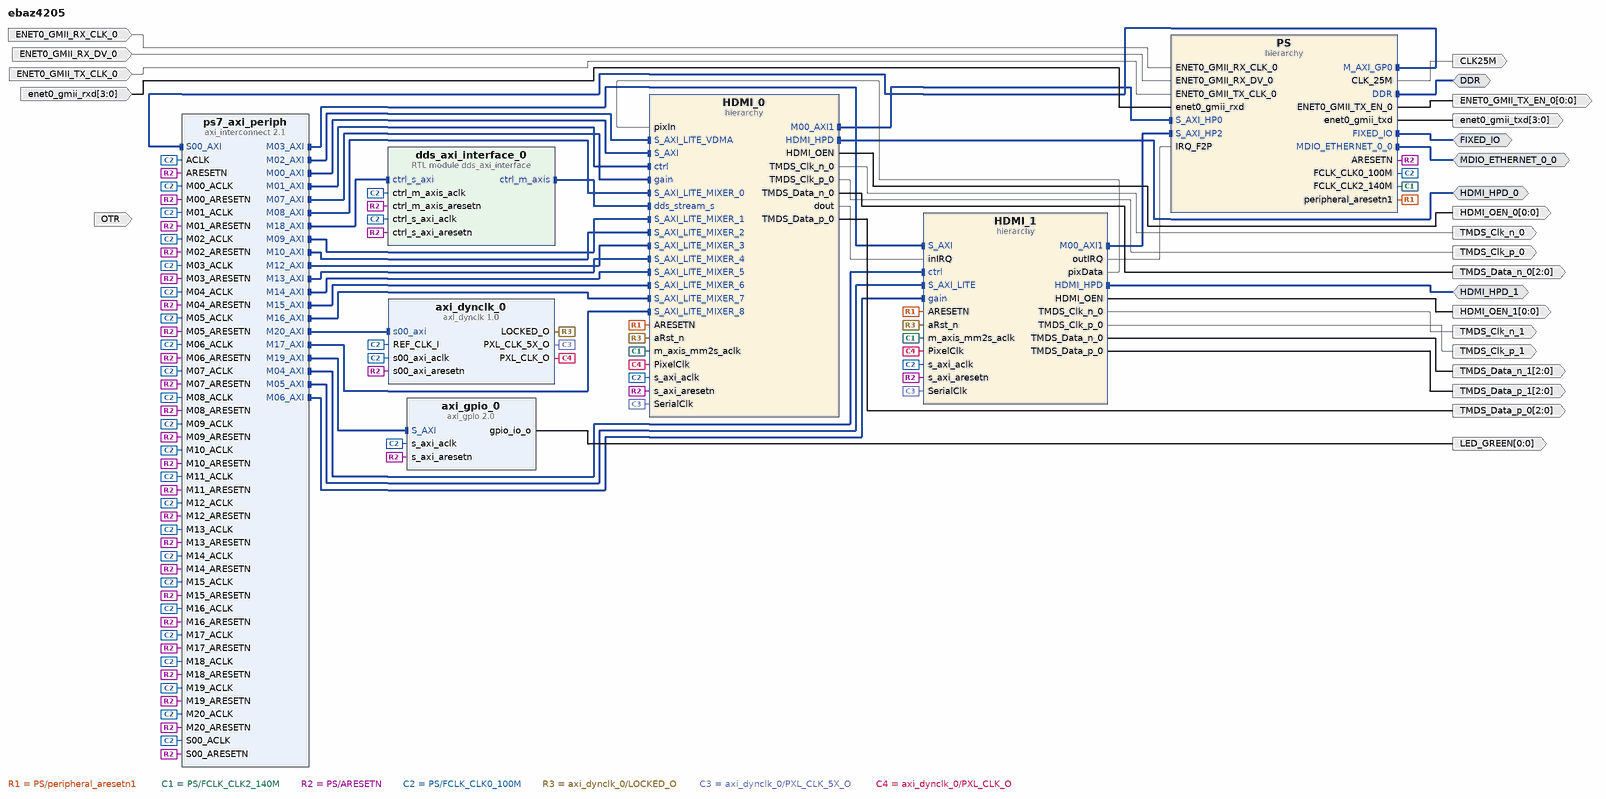
[diagram p0: block diagram of the top level]
# Vivado block design ebaz4205, xc7z010clg400-1, Vivado 2022.2
create_bd_design ebaz4205

create_bd_intf_port -mode Master -vlnv xilinx.com:interface:ddrx_rtl:1.0 DDR
create_bd_intf_port -mode Master -vlnv xilinx.com:display_processing_system7:fixedio_rtl:1.0 FIXED_IO
create_bd_intf_port -mode Master -vlnv xilinx.com:interface:mdio_rtl:1.0 MDIO_ETHERNET_0_0
create_bd_intf_port -mode Master -vlnv xilinx.com:interface:gpio_rtl:1.0 HDMI_HPD_0
create_bd_intf_port -mode Master -vlnv xilinx.com:interface:gpio_rtl:1.0 HDMI_HPD_1
create_bd_port -dir I -type clk ENET0_GMII_RX_CLK_0
create_bd_port -dir I ENET0_GMII_RX_DV_0
create_bd_port -dir I -type clk ENET0_GMII_TX_CLK_0
create_bd_port -dir O -from 0 -to 0 ENET0_GMII_TX_EN_0
create_bd_port -dir I -from 3 -to 0 enet0_gmii_rxd
create_bd_port -dir O -from 3 -to 0 enet0_gmii_txd
create_bd_port -dir O -type clk CLK25M
set_property -dict {CONFIG.FREQ_HZ 25000000} [get_bd_ports CLK25M]
create_bd_port -dir I -type data OTR
create_bd_port -dir O -from 0 -to 0 -type data LED_GREEN
create_bd_port -dir O -from 0 -to 0 HDMI_OEN_0
create_bd_port -dir O TMDS_Clk_p_0
create_bd_port -dir O TMDS_Clk_n_0
create_bd_port -dir O -from 2 -to 0 TMDS_Data_p_0
create_bd_port -dir O -from 2 -to 0 TMDS_Data_n_0
create_bd_port -dir O -from 0 -to 0 HDMI_OEN_1
create_bd_port -dir O TMDS_Clk_n_1
create_bd_port -dir O TMDS_Clk_p_1
create_bd_port -dir O -from 2 -to 0 TMDS_Data_n_1
create_bd_port -dir O -from 2 -to 0 TMDS_Data_p_1

create_bd_cell -type hier PS
create_bd_cell -type hier HDMI_0
create_bd_cell -type ip -vlnv xilinx.com:ip:axi_interconnect:2.1 ps7_axi_periph
set_property -dict [list \
  CONFIG.ENABLE_ADVANCED_OPTIONS 0 \
  CONFIG.NUM_MI 21 \
  CONFIG.NUM_SI 1 \
  CONFIG.STRATEGY 1 \
] [get_bd_cells ps7_axi_periph]
create_bd_cell -type hier HDMI_1
create_bd_cell -type ip -vlnv xilinx.com:ip:axi_gpio:2.0 axi_gpio_0
set_property -dict {CONFIG.C_GPIO_WIDTH 1} [get_bd_cells axi_gpio_0]
create_bd_cell -type ip -vlnv digilentinc.com:ip:axi_dynclk:1.0 axi_dynclk_0
create_bd_cell -type module -reference dds_axi_interface dds_axi_interface_0

# ---- hierarchy /PS ----
current_bd_instance /PS
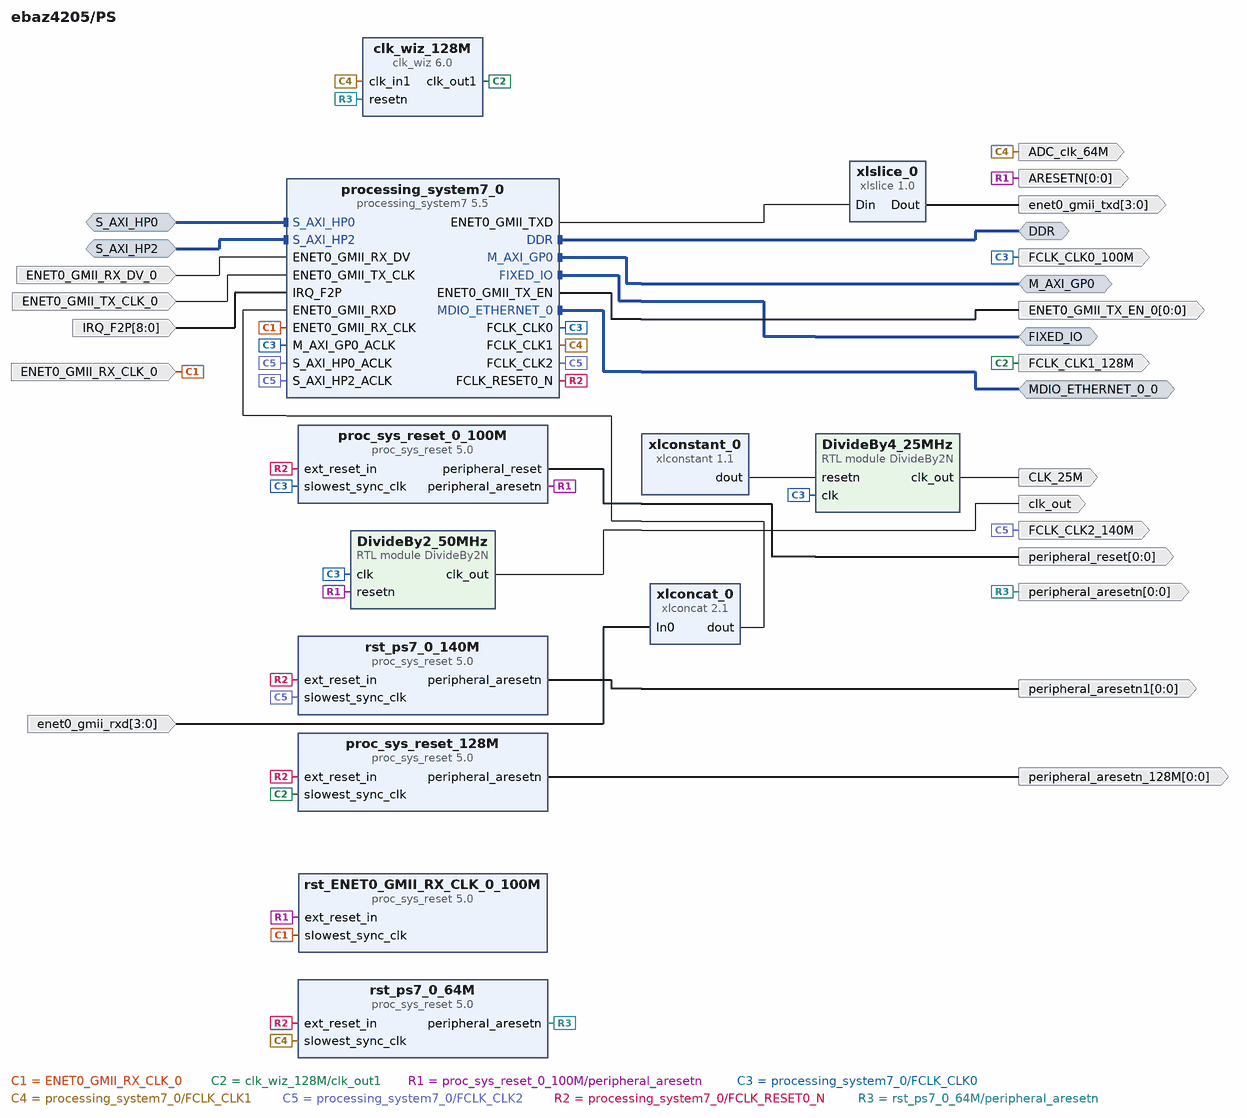
[diagram p1: block diagram inside /PS]
create_bd_intf_pin -mode Master -vlnv xilinx.com:interface:mdio_rtl:1.0 MDIO_ETHERNET_0_0
create_bd_intf_pin -mode Master -vlnv xilinx.com:interface:ddrx_rtl:1.0 DDR
create_bd_intf_pin -mode Master -vlnv xilinx.com:display_processing_system7:fixedio_rtl:1.0 FIXED_IO
create_bd_intf_pin -mode Slave -vlnv xilinx.com:interface:aximm_rtl:1.0 S_AXI_HP0
create_bd_intf_pin -mode Master -vlnv xilinx.com:interface:aximm_rtl:1.0 M_AXI_GP0
create_bd_intf_pin -mode Slave -vlnv xilinx.com:interface:aximm_rtl:1.0 S_AXI_HP2
create_bd_pin -dir O -from 0 -to 0 ENET0_GMII_TX_EN_0
create_bd_pin -dir I -type clk ENET0_GMII_RX_CLK_0
create_bd_pin -dir I ENET0_GMII_RX_DV_0
create_bd_pin -dir I -type clk ENET0_GMII_TX_CLK_0
create_bd_pin -dir O -type clk FCLK_CLK0_100M
create_bd_pin -dir O -type clk CLK_25M
create_bd_pin -dir O -from 3 -to 0 enet0_gmii_txd
create_bd_pin -dir O -from 0 -to 0 -type rst ARESETN
create_bd_pin -dir I -from 3 -to 0 enet0_gmii_rxd
create_bd_pin -dir O -type clk FCLK_CLK1_128M
create_bd_pin -dir O -from 0 -to 0 -type rst peripheral_reset
create_bd_pin -dir O -from 0 -to 0 -type rst peripheral_aresetn_128M
create_bd_pin -dir O -type clk FCLK_CLK2_140M
create_bd_pin -dir O -from 0 -to 0 -type rst peripheral_aresetn1
create_bd_pin -dir I -from 8 -to 0 -type intr IRQ_F2P
create_bd_pin -dir O ADC_clk_64M
create_bd_pin -dir O -from 0 -to 0 -type rst peripheral_aresetn
create_bd_pin -dir O clk_out

create_bd_cell -type ip -vlnv xilinx.com:ip:xlslice:1.0 xlslice_0
set_property -dict {CONFIG.DIN_FROM 3 CONFIG.DIN_TO 0 CONFIG.DIN_WIDTH 8 CONFIG.DOUT_WIDTH 4} [get_bd_cells xlslice_0]
create_bd_cell -type ip -vlnv xilinx.com:ip:xlconcat:2.1 xlconcat_0
set_property -dict {CONFIG.IN0_WIDTH 4 CONFIG.IN1_WIDTH 4 CONFIG.NUM_PORTS 2} [get_bd_cells xlconcat_0]
create_bd_cell -type ip -vlnv xilinx.com:ip:xlconstant:1.1 xlconstant_0
create_bd_cell -type module -reference DivideBy2N DivideBy2_50MHz
set_property -dict {CONFIG.N 1 CONFIG.WIDTH 2} [get_bd_cells DivideBy2_50MHz]
create_bd_cell -type ip -vlnv xilinx.com:ip:proc_sys_reset:5.0 proc_sys_reset_128M
create_bd_cell -type ip -vlnv xilinx.com:ip:proc_sys_reset:5.0 rst_ENET0_GMII_RX_CLK_0_100M
create_bd_cell -type ip -vlnv xilinx.com:ip:clk_wiz:6.0 clk_wiz_128M
set_property -dict [list \
  CONFIG.CLKIN1_JITTER_PS 156.25 \
  CONFIG.CLKOUT1_DRIVES BUFG \
  CONFIG.CLKOUT1_JITTER 149.670 \
  CONFIG.CLKOUT1_PHASE_ERROR 114.696 \
  CONFIG.CLKOUT1_REQUESTED_OUT_FREQ 128 \
  CONFIG.CLKOUT2_DRIVES BUFG \
  CONFIG.CLKOUT3_DRIVES BUFG \
  CONFIG.CLKOUT4_DRIVES BUFG \
  CONFIG.CLKOUT5_DRIVES BUFG \
  CONFIG.CLKOUT6_DRIVES BUFG \
  CONFIG.CLKOUT7_DRIVES BUFG \
  CONFIG.MMCM_BANDWIDTH OPTIMIZED \
  CONFIG.MMCM_CLKFBOUT_MULT_F 14 \
  CONFIG.MMCM_CLKIN1_PERIOD 15.625 \
  CONFIG.MMCM_CLKIN2_PERIOD 10.000 \
  CONFIG.MMCM_CLKOUT0_DIVIDE_F 7 \
  CONFIG.MMCM_COMPENSATION ZHOLD \
  CONFIG.PRIMITIVE PLL \
  CONFIG.PRIM_IN_FREQ 64.000 \
  CONFIG.RESET_PORT resetn \
  CONFIG.RESET_TYPE ACTIVE_LOW \
] [get_bd_cells clk_wiz_128M]
create_bd_cell -type module -reference DivideBy2N DivideBy4_25MHz
set_property -dict {CONFIG.N 2 CONFIG.WIDTH 2} [get_bd_cells DivideBy4_25MHz]
create_bd_cell -type ip -vlnv xilinx.com:ip:proc_sys_reset:5.0 proc_sys_reset_0_100M
create_bd_cell -type ip -vlnv xilinx.com:ip:processing_system7:5.5 processing_system7_0
set_property -dict [list \
  CONFIG.PCW_APU_PERIPHERAL_FREQMHZ 666.666666 \
  CONFIG.PCW_ENET0_ENET0_IO EMIO \
  CONFIG.PCW_ENET0_GRP_MDIO_ENABLE 1 \
  CONFIG.PCW_ENET0_GRP_MDIO_IO EMIO \
  CONFIG.PCW_ENET0_PERIPHERAL_ENABLE 1 \
  CONFIG.PCW_ENET0_PERIPHERAL_FREQMHZ {100 Mbps} \
  CONFIG.PCW_ENET0_RESET_ENABLE 0 \
  CONFIG.PCW_ENET_RESET_ENABLE 1 \
  CONFIG.PCW_ENET_RESET_SELECT {Share reset pin} \
  CONFIG.PCW_EN_CLK1_PORT 1 \
  CONFIG.PCW_EN_CLK2_PORT 1 \
  CONFIG.PCW_EN_CLK3_PORT 1 \
  CONFIG.PCW_FCLK_CLK1_BUF TRUE \
  CONFIG.PCW_FCLK_CLK2_BUF TRUE \
  CONFIG.PCW_FCLK_CLK3_BUF TRUE \
  CONFIG.PCW_FPGA0_PERIPHERAL_FREQMHZ 100 \
  CONFIG.PCW_FPGA1_PERIPHERAL_FREQMHZ 64 \
  CONFIG.PCW_FPGA2_PERIPHERAL_FREQMHZ 142 \
  CONFIG.PCW_FPGA3_PERIPHERAL_FREQMHZ 25 \
  CONFIG.PCW_FPGA_FCLK1_ENABLE 1 \
  CONFIG.PCW_FPGA_FCLK2_ENABLE 1 \
  CONFIG.PCW_FPGA_FCLK3_ENABLE 1 \
  CONFIG.PCW_GPIO_EMIO_GPIO_ENABLE 1 \
  CONFIG.PCW_GPIO_EMIO_GPIO_IO 64 \
  CONFIG.PCW_GPIO_MIO_GPIO_ENABLE 1 \
  CONFIG.PCW_GPIO_MIO_GPIO_IO MIO \
  CONFIG.PCW_I2C_RESET_ENABLE 1 \
  CONFIG.PCW_IRQ_F2P_INTR 1 \
  CONFIG.PCW_NAND_NAND_IO {MIO 0 2.. 14} \
  CONFIG.PCW_NAND_PERIPHERAL_ENABLE 1 \
  CONFIG.PCW_PERIPHERAL_BOARD_PRESET part0 \
  CONFIG.PCW_PRESET_BANK1_VOLTAGE {LVCMOS 3.3V} \
  CONFIG.PCW_SD0_GRP_CD_ENABLE 1 \
  CONFIG.PCW_SD0_GRP_CD_IO {MIO 34} \
  CONFIG.PCW_SD0_GRP_WP_ENABLE 0 \
  CONFIG.PCW_SD0_PERIPHERAL_ENABLE 1 \
  CONFIG.PCW_SD0_SD0_IO {MIO 40 .. 45} \
  CONFIG.PCW_SDIO_PERIPHERAL_FREQMHZ 25 \
  CONFIG.PCW_UART1_PERIPHERAL_ENABLE 1 \
  CONFIG.PCW_UART1_UART1_IO {MIO 24 .. 25} \
  CONFIG.PCW_UART_PERIPHERAL_FREQMHZ 100 \
  CONFIG.PCW_UIPARAM_DDR_BUS_WIDTH {16 Bit} \
  CONFIG.PCW_UIPARAM_DDR_FREQ_MHZ 533.333333 \
  CONFIG.PCW_UIPARAM_DDR_PARTNO {MT41K128M16 JT-125} \
  CONFIG.PCW_USB0_PERIPHERAL_ENABLE 0 \
  CONFIG.PCW_USB_RESET_ENABLE 1 \
  CONFIG.PCW_USE_FABRIC_INTERRUPT 1 \
  CONFIG.PCW_USE_S_AXI_HP0 1 \
  CONFIG.PCW_USE_S_AXI_HP2 1 \
  CONFIG.preset None \
] [get_bd_cells processing_system7_0]
# 500 more settings of processing_system7_0 are not shown: defaults, MIO pin electricals, DDR timing, and values the tool derives
create_bd_cell -type ip -vlnv xilinx.com:ip:proc_sys_reset:5.0 rst_ps7_0_140M
create_bd_cell -type ip -vlnv xilinx.com:ip:proc_sys_reset:5.0 rst_ps7_0_64M

# ---- hierarchy /HDMI_0 ----
current_bd_instance /HDMI_0
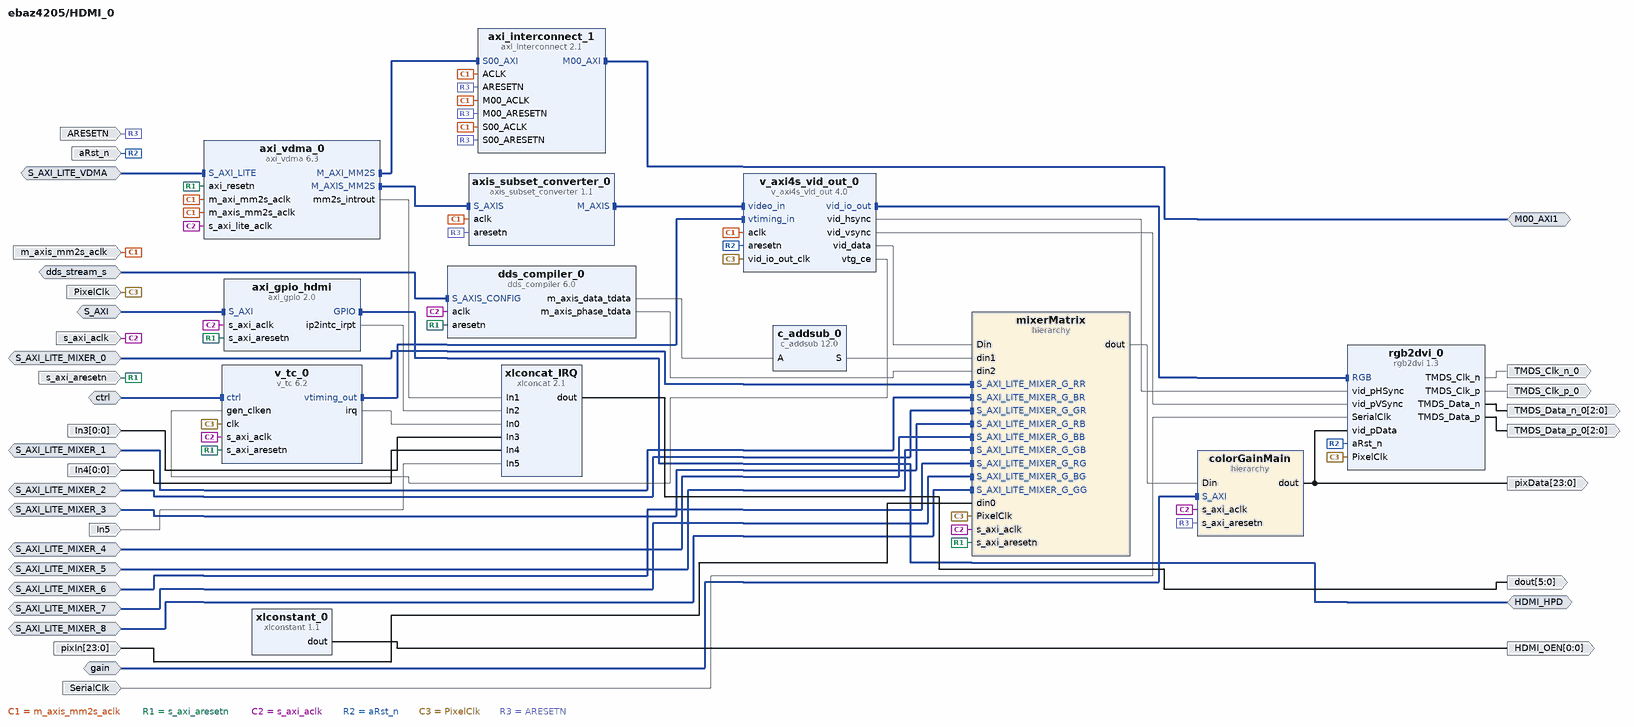
[diagram p2: block diagram inside /HDMI_0]
create_bd_intf_pin -mode Slave -vlnv xilinx.com:interface:aximm_rtl:1.0 S_AXI
create_bd_intf_pin -mode Master -vlnv xilinx.com:interface:gpio_rtl:1.0 HDMI_HPD
create_bd_intf_pin -mode Slave -vlnv xilinx.com:interface:aximm_rtl:1.0 ctrl
create_bd_intf_pin -mode Master -vlnv xilinx.com:interface:aximm_rtl:1.0 M00_AXI1
create_bd_intf_pin -mode Slave -vlnv xilinx.com:interface:aximm_rtl:1.0 S_AXI_LITE_VDMA
create_bd_intf_pin -mode Slave -vlnv xilinx.com:interface:aximm_rtl:1.0 gain
create_bd_intf_pin -mode Slave -vlnv xilinx.com:interface:aximm_rtl:1.0 S_AXI_LITE_MIXER_0
create_bd_intf_pin -mode Slave -vlnv xilinx.com:interface:aximm_rtl:1.0 S_AXI_LITE_MIXER_1
create_bd_intf_pin -mode Slave -vlnv xilinx.com:interface:aximm_rtl:1.0 S_AXI_LITE_MIXER_2
create_bd_intf_pin -mode Slave -vlnv xilinx.com:interface:aximm_rtl:1.0 S_AXI_LITE_MIXER_3
create_bd_intf_pin -mode Slave -vlnv xilinx.com:interface:aximm_rtl:1.0 S_AXI_LITE_MIXER_4
create_bd_intf_pin -mode Slave -vlnv xilinx.com:interface:aximm_rtl:1.0 S_AXI_LITE_MIXER_5
create_bd_intf_pin -mode Slave -vlnv xilinx.com:interface:aximm_rtl:1.0 S_AXI_LITE_MIXER_6
create_bd_intf_pin -mode Slave -vlnv xilinx.com:interface:aximm_rtl:1.0 S_AXI_LITE_MIXER_7
create_bd_intf_pin -mode Slave -vlnv xilinx.com:interface:aximm_rtl:1.0 S_AXI_LITE_MIXER_8
create_bd_intf_pin -mode Slave -vlnv xilinx.com:interface:axis_rtl:1.0 dds_stream_s
create_bd_pin -dir I -type clk s_axi_aclk
create_bd_pin -dir I -type clk m_axis_mm2s_aclk
create_bd_pin -dir I -type rst s_axi_aresetn
create_bd_pin -dir O -from 0 -to 0 HDMI_OEN
create_bd_pin -dir I -type rst ARESETN
create_bd_pin -dir O TMDS_Clk_p_0
create_bd_pin -dir O TMDS_Clk_n_0
create_bd_pin -dir O -from 2 -to 0 TMDS_Data_p_0
create_bd_pin -dir O -from 2 -to 0 TMDS_Data_n_0
create_bd_pin -dir O -from 5 -to 0 dout
create_bd_pin -dir I -from 0 -to 0 -type intr In3
create_bd_pin -dir I -from 0 -to 0 -type intr In4
create_bd_pin -dir I -type intr In5
create_bd_pin -dir I -type rst aRst_n
create_bd_pin -dir I -type clk PixelClk
create_bd_pin -dir I SerialClk
create_bd_pin -dir O -from 23 -to 0 pixData
create_bd_pin -dir I -from 23 -to 0 pixIn

create_bd_cell -type ip -vlnv xilinx.com:ip:xlconstant:1.1 xlconstant_0
create_bd_cell -type ip -vlnv xilinx.com:ip:xlconcat:2.1 xlconcat_IRQ
set_property -dict {CONFIG.NUM_PORTS 6} [get_bd_cells xlconcat_IRQ]
create_bd_cell -type ip -vlnv xilinx.com:ip:axi_interconnect:2.1 axi_interconnect_1
set_property -dict [list \
  CONFIG.NUM_MI 1 \
  CONFIG.NUM_SI 1 \
  CONFIG.S00_HAS_DATA_FIFO 2 \
  CONFIG.S00_HAS_REGSLICE 4 \
] [get_bd_cells axi_interconnect_1]
create_bd_cell -type ip -vlnv xilinx.com:ip:axi_gpio:2.0 axi_gpio_hdmi
set_property -dict {CONFIG.C_ALL_INPUTS 1 CONFIG.C_GPIO_WIDTH 1 CONFIG.C_INTERRUPT_PRESENT 1} [get_bd_cells axi_gpio_hdmi]
create_bd_cell -type ip -vlnv xilinx.com:ip:axis_subset_converter:1.1 axis_subset_converter_0
set_property -dict [list \
  CONFIG.M_HAS_TKEEP 1 \
  CONFIG.M_HAS_TLAST 1 \
  CONFIG.M_TDATA_NUM_BYTES 3 \
  CONFIG.M_TUSER_WIDTH 1 \
  CONFIG.S_HAS_TKEEP 1 \
  CONFIG.S_HAS_TLAST 1 \
  CONFIG.S_TDATA_NUM_BYTES 4 \
  CONFIG.S_TUSER_WIDTH 1 \
  CONFIG.TDATA_REMAP {tdata[23:16],tdata[7:0],tdata[15:8]} \
  CONFIG.TKEEP_REMAP {tkeep[2:0]} \
  CONFIG.TLAST_REMAP {tlast[0]} \
  CONFIG.TUSER_REMAP {tuser[0:0]} \
] [get_bd_cells axis_subset_converter_0]
create_bd_cell -type ip -vlnv digilentinc.com:ip:rgb2dvi:1.3 rgb2dvi_0
set_property -dict {CONFIG.kClkRange 2 CONFIG.kGenerateSerialClk false CONFIG.kRstActiveHigh false} [get_bd_cells rgb2dvi_0]
create_bd_cell -type ip -vlnv xilinx.com:ip:v_axi4s_vid_out:4.0 v_axi4s_vid_out_0
set_property -dict {CONFIG.C_ADDR_WIDTH 12 CONFIG.C_HAS_ASYNC_CLK 1 CONFIG.C_VTG_MASTER_SLAVE 1} [get_bd_cells v_axi4s_vid_out_0]
create_bd_cell -type ip -vlnv xilinx.com:ip:v_tc:6.2 v_tc_0
set_property -dict {CONFIG.enable_detection false} [get_bd_cells v_tc_0]
create_bd_cell -type ip -vlnv xilinx.com:ip:axi_vdma:6.3 axi_vdma_0
set_property -dict [list \
  CONFIG.c_include_s2mm 0 \
  CONFIG.c_m_axis_mm2s_tdata_width 32 \
  CONFIG.c_mm2s_linebuffer_depth 4096 \
  CONFIG.c_mm2s_max_burst_length 16 \
  CONFIG.c_num_fstores 3 \
] [get_bd_cells axi_vdma_0]
create_bd_cell -type hier colorGainMain
create_bd_cell -type hier mixerMatrix
create_bd_cell -type ip -vlnv xilinx.com:ip:dds_compiler:6.0 dds_compiler_0
set_property -dict [list \
  CONFIG.Channels 1 \
  CONFIG.DATA_Has_TLAST Not_Required \
  CONFIG.DDS_Clock_Rate 100 \
  CONFIG.Has_ACLKEN false \
  CONFIG.Has_ARESETn true \
  CONFIG.Has_TREADY false \
  CONFIG.Latency 7 \
  CONFIG.M_DATA_Has_TUSER Not_Required \
  CONFIG.M_PHASE_Has_TUSER Not_Required \
  CONFIG.Noise_Shaping None \
  CONFIG.Output_Frequency1 0 \
  CONFIG.Output_Selection Sine \
  CONFIG.Output_Width 16 \
  CONFIG.PINC1 1 \
  CONFIG.Parameter_Entry Hardware_Parameters \
  CONFIG.Phase_Increment Programmable \
  CONFIG.Phase_Width 32 \
  CONFIG.S_PHASE_Has_TUSER Not_Required \
] [get_bd_cells dds_compiler_0]
create_bd_cell -type ip -vlnv xilinx.com:ip:c_addsub:12.0 c_addsub_0
set_property -dict [list \
  CONFIG.A_Width 16 \
  CONFIG.B_Constant true \
  CONFIG.B_Type Unsigned \
  CONFIG.B_Value 1000000000000000 \
  CONFIG.B_Width 16 \
  CONFIG.CE false \
  CONFIG.Latency 0 \
  CONFIG.Out_Width 16 \
] [get_bd_cells c_addsub_0]

# ---- hierarchy /HDMI_0/colorGainMain ----
current_bd_instance /HDMI_0/colorGainMain
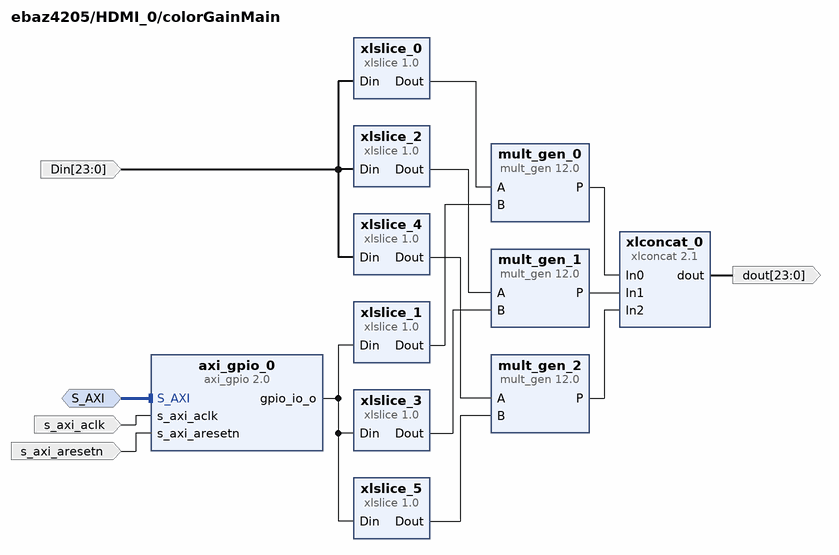
[diagram p3: block diagram inside /HDMI_0/colorGainMain]
create_bd_intf_pin -mode Slave -vlnv xilinx.com:interface:aximm_rtl:1.0 S_AXI
create_bd_pin -dir I -from 23 -to 0 Din
create_bd_pin -dir I -type clk s_axi_aclk
create_bd_pin -dir I -type rst s_axi_aresetn
create_bd_pin -dir O -from 23 -to 0 dout

create_bd_cell -type ip -vlnv xilinx.com:ip:xlslice:1.0 xlslice_0
set_property -dict {CONFIG.DIN_TO 0 CONFIG.DIN_WIDTH 24 CONFIG.DOUT_WIDTH 8} [get_bd_cells xlslice_0]
create_bd_cell -type ip -vlnv xilinx.com:ip:mult_gen:12.0 mult_gen_1
set_property -dict [list \
  CONFIG.MultType Parallel_Multiplier \
  CONFIG.OutputWidthLow 8 \
  CONFIG.PipeStages 0 \
  CONFIG.PortAType Unsigned \
  CONFIG.PortAWidth 8 \
  CONFIG.PortBType Unsigned \
  CONFIG.PortBWidth 8 \
  CONFIG.Use_Custom_Output_Width true \
] [get_bd_cells mult_gen_1]
create_bd_cell -type ip -vlnv xilinx.com:ip:xlslice:1.0 xlslice_1
set_property -dict {CONFIG.DIN_TO 0 CONFIG.DIN_WIDTH 24 CONFIG.DOUT_WIDTH 8} [get_bd_cells xlslice_1]
create_bd_cell -type ip -vlnv xilinx.com:ip:xlslice:1.0 xlslice_2
set_property -dict {CONFIG.DIN_FROM 15 CONFIG.DIN_TO 8 CONFIG.DIN_WIDTH 24 CONFIG.DOUT_WIDTH 8} [get_bd_cells xlslice_2]
create_bd_cell -type ip -vlnv xilinx.com:ip:mult_gen:12.0 mult_gen_2
set_property -dict [list \
  CONFIG.MultType Parallel_Multiplier \
  CONFIG.OutputWidthLow 8 \
  CONFIG.PipeStages 0 \
  CONFIG.PortAType Unsigned \
  CONFIG.PortAWidth 8 \
  CONFIG.PortBType Unsigned \
  CONFIG.PortBWidth 8 \
  CONFIG.Use_Custom_Output_Width true \
] [get_bd_cells mult_gen_2]
create_bd_cell -type ip -vlnv xilinx.com:ip:xlslice:1.0 xlslice_3
set_property -dict {CONFIG.DIN_FROM 15 CONFIG.DIN_TO 8 CONFIG.DIN_WIDTH 24 CONFIG.DOUT_WIDTH 8} [get_bd_cells xlslice_3]
create_bd_cell -type ip -vlnv xilinx.com:ip:xlslice:1.0 xlslice_4
set_property -dict {CONFIG.DIN_FROM 23 CONFIG.DIN_TO 16 CONFIG.DIN_WIDTH 24 CONFIG.DOUT_WIDTH 8} [get_bd_cells xlslice_4]
create_bd_cell -type ip -vlnv xilinx.com:ip:xlslice:1.0 xlslice_5
set_property -dict {CONFIG.DIN_FROM 23 CONFIG.DIN_TO 16 CONFIG.DIN_WIDTH 24 CONFIG.DOUT_WIDTH 8} [get_bd_cells xlslice_5]
create_bd_cell -type ip -vlnv xilinx.com:ip:mult_gen:12.0 mult_gen_0
set_property -dict [list \
  CONFIG.MultType Parallel_Multiplier \
  CONFIG.OutputWidthLow 8 \
  CONFIG.PipeStages 0 \
  CONFIG.PortAType Unsigned \
  CONFIG.PortAWidth 8 \
  CONFIG.PortBType Unsigned \
  CONFIG.PortBWidth 8 \
  CONFIG.Use_Custom_Output_Width true \
] [get_bd_cells mult_gen_0]
create_bd_cell -type ip -vlnv xilinx.com:ip:xlconcat:2.1 xlconcat_0
set_property -dict {CONFIG.IN0_WIDTH 8 CONFIG.IN1_WIDTH 8 CONFIG.IN2_WIDTH 8 CONFIG.NUM_PORTS 3} [get_bd_cells xlconcat_0]
create_bd_cell -type ip -vlnv xilinx.com:ip:axi_gpio:2.0 axi_gpio_0
set_property -dict {CONFIG.C_ALL_OUTPUTS 1 CONFIG.C_DOUT_DEFAULT 0xFFFFFFFF CONFIG.C_GPIO_WIDTH 24} [get_bd_cells axi_gpio_0]

# ---- hierarchy /HDMI_0/mixerMatrix ----
current_bd_instance /HDMI_0/mixerMatrix
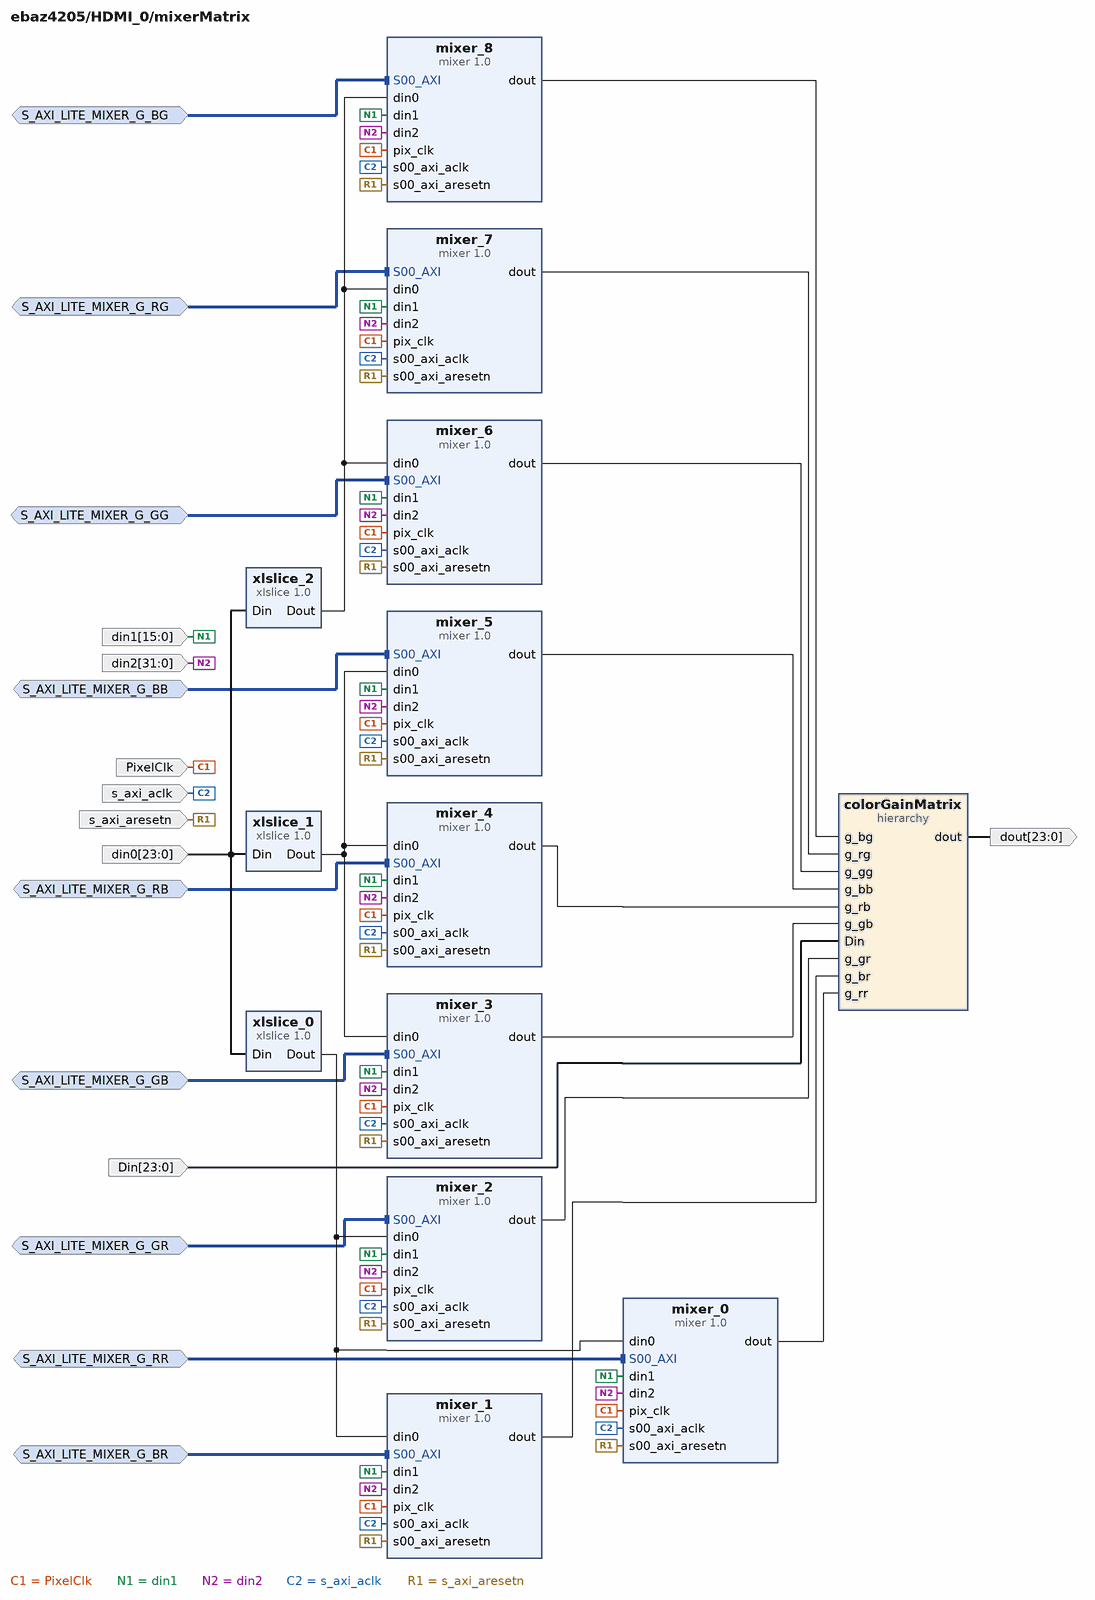
[diagram p4: block diagram inside /HDMI_0/mixerMatrix]
create_bd_intf_pin -mode Slave -vlnv xilinx.com:interface:aximm_rtl:1.0 S_AXI_LITE_MIXER_G_RR
create_bd_intf_pin -mode Slave -vlnv xilinx.com:interface:aximm_rtl:1.0 S_AXI_LITE_MIXER_G_BR
create_bd_intf_pin -mode Slave -vlnv xilinx.com:interface:aximm_rtl:1.0 S_AXI_LITE_MIXER_G_GR
create_bd_intf_pin -mode Slave -vlnv xilinx.com:interface:aximm_rtl:1.0 S_AXI_LITE_MIXER_G_RB
create_bd_intf_pin -mode Slave -vlnv xilinx.com:interface:aximm_rtl:1.0 S_AXI_LITE_MIXER_G_BB
create_bd_intf_pin -mode Slave -vlnv xilinx.com:interface:aximm_rtl:1.0 S_AXI_LITE_MIXER_G_GB
create_bd_intf_pin -mode Slave -vlnv xilinx.com:interface:aximm_rtl:1.0 S_AXI_LITE_MIXER_G_RG
create_bd_intf_pin -mode Slave -vlnv xilinx.com:interface:aximm_rtl:1.0 S_AXI_LITE_MIXER_G_BG
create_bd_intf_pin -mode Slave -vlnv xilinx.com:interface:aximm_rtl:1.0 S_AXI_LITE_MIXER_G_GG
create_bd_pin -dir I -from 23 -to 0 Din
create_bd_pin -dir O -from 23 -to 0 dout
create_bd_pin -dir I -type clk s_axi_aclk
create_bd_pin -dir I -from 15 -to 0 din1
create_bd_pin -dir I -from 31 -to 0 din2
create_bd_pin -dir I -type rst s_axi_aresetn
create_bd_pin -dir I -type clk PixelClk
create_bd_pin -dir I -from 23 -to 0 din0

create_bd_cell -type hier colorGainMatrix
create_bd_cell -type ip -vlnv xilinx.com:ip:xlslice:1.0 xlslice_0
set_property -dict {CONFIG.DIN_FROM 23 CONFIG.DIN_TO 16 CONFIG.DIN_WIDTH 24} [get_bd_cells xlslice_0]
create_bd_cell -type ip -vlnv xilinx.com:ip:xlslice:1.0 xlslice_1
set_property -dict {CONFIG.DIN_FROM 15 CONFIG.DIN_TO 8 CONFIG.DIN_WIDTH 24} [get_bd_cells xlslice_1]
create_bd_cell -type ip -vlnv xilinx.com:ip:xlslice:1.0 xlslice_2
set_property -dict {CONFIG.DIN_FROM 7 CONFIG.DIN_TO 0 CONFIG.DIN_WIDTH 24} [get_bd_cells xlslice_2]
create_bd_cell -type ip -vlnv user.org:user:mixer:1.0 mixer_0
set_property -dict {CONFIG.IN_NUM 3 CONFIG.IN_WIDTH 16 CONFIG.OUT_WIDTH 16} [get_bd_cells mixer_0]
create_bd_cell -type ip -vlnv user.org:user:mixer:1.0 mixer_1
set_property -dict {CONFIG.IN_NUM 3 CONFIG.IN_WIDTH 16 CONFIG.OUT_WIDTH 16} [get_bd_cells mixer_1]
create_bd_cell -type ip -vlnv user.org:user:mixer:1.0 mixer_2
set_property -dict {CONFIG.IN_NUM 3 CONFIG.IN_WIDTH 16 CONFIG.OUT_WIDTH 16} [get_bd_cells mixer_2]
create_bd_cell -type ip -vlnv user.org:user:mixer:1.0 mixer_3
set_property -dict {CONFIG.IN_NUM 3 CONFIG.IN_WIDTH 16 CONFIG.OUT_WIDTH 16} [get_bd_cells mixer_3]
create_bd_cell -type ip -vlnv user.org:user:mixer:1.0 mixer_6
set_property -dict {CONFIG.IN_NUM 3 CONFIG.IN_WIDTH 16 CONFIG.OUT_WIDTH 16} [get_bd_cells mixer_6]
create_bd_cell -type ip -vlnv user.org:user:mixer:1.0 mixer_4
set_property -dict {CONFIG.IN_NUM 3 CONFIG.IN_WIDTH 16 CONFIG.OUT_WIDTH 16} [get_bd_cells mixer_4]
create_bd_cell -type ip -vlnv user.org:user:mixer:1.0 mixer_7
set_property -dict {CONFIG.IN_NUM 3 CONFIG.IN_WIDTH 16 CONFIG.OUT_WIDTH 16} [get_bd_cells mixer_7]
create_bd_cell -type ip -vlnv user.org:user:mixer:1.0 mixer_5
set_property -dict {CONFIG.IN_NUM 3 CONFIG.IN_WIDTH 16 CONFIG.OUT_WIDTH 16} [get_bd_cells mixer_5]
create_bd_cell -type ip -vlnv user.org:user:mixer:1.0 mixer_8
set_property -dict {CONFIG.IN_NUM 3 CONFIG.IN_WIDTH 16 CONFIG.OUT_WIDTH 16} [get_bd_cells mixer_8]

# ---- hierarchy /HDMI_0/mixerMatrix/colorGainMatrix ----
current_bd_instance /HDMI_0/mixerMatrix/colorGainMatrix
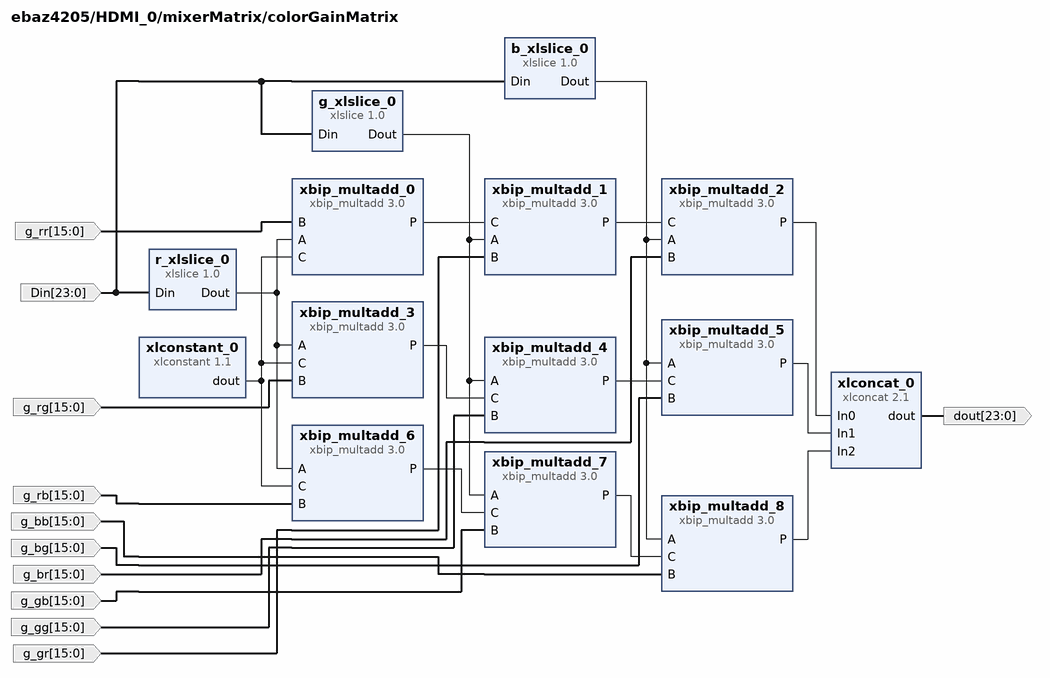
[diagram p5: block diagram inside /HDMI_0/mixerMatrix/colorGainMatrix]
create_bd_pin -dir I -from 23 -to 0 Din
create_bd_pin -dir O -from 23 -to 0 dout
create_bd_pin -dir I -from 15 -to 0 g_rr
create_bd_pin -dir I -from 15 -to 0 g_br
create_bd_pin -dir I -from 15 -to 0 g_gr
create_bd_pin -dir I -from 15 -to 0 g_bg
create_bd_pin -dir I -from 15 -to 0 g_gg
create_bd_pin -dir I -from 15 -to 0 g_rg
create_bd_pin -dir I -from 15 -to 0 g_bb
create_bd_pin -dir I -from 15 -to 0 g_gb
create_bd_pin -dir I -from 15 -to 0 g_rb

create_bd_cell -type ip -vlnv xilinx.com:ip:xlslice:1.0 b_xlslice_0
set_property -dict {CONFIG.DIN_TO 0 CONFIG.DIN_WIDTH 24 CONFIG.DOUT_WIDTH 8} [get_bd_cells b_xlslice_0]
create_bd_cell -type ip -vlnv xilinx.com:ip:xlslice:1.0 g_xlslice_0
set_property -dict {CONFIG.DIN_FROM 15 CONFIG.DIN_TO 8 CONFIG.DIN_WIDTH 24 CONFIG.DOUT_WIDTH 8} [get_bd_cells g_xlslice_0]
create_bd_cell -type ip -vlnv xilinx.com:ip:xlslice:1.0 r_xlslice_0
set_property -dict {CONFIG.DIN_FROM 23 CONFIG.DIN_TO 16 CONFIG.DIN_WIDTH 24 CONFIG.DOUT_WIDTH 8} [get_bd_cells r_xlslice_0]
create_bd_cell -type ip -vlnv xilinx.com:ip:xlconcat:2.1 xlconcat_0
set_property -dict {CONFIG.IN0_WIDTH 8 CONFIG.IN1_WIDTH 8 CONFIG.IN2_WIDTH 8 CONFIG.NUM_PORTS 3} [get_bd_cells xlconcat_0]
create_bd_cell -type ip -vlnv xilinx.com:ip:xlconstant:1.1 xlconstant_0
set_property -dict {CONFIG.CONST_VAL 0 CONFIG.CONST_WIDTH 16} [get_bd_cells xlconstant_0]
create_bd_cell -type ip -vlnv xilinx.com:ip:xbip_multadd:3.0 xbip_multadd_0
set_property -dict [list \
  CONFIG.c_a_type 1 \
  CONFIG.c_a_width 8 \
  CONFIG.c_ab_latency 0 \
  CONFIG.c_b_type 1 \
  CONFIG.c_b_width 16 \
  CONFIG.c_c_latency 0 \
  CONFIG.c_c_type 1 \
  CONFIG.c_c_width 16 \
  CONFIG.c_out_high 23 \
  CONFIG.c_out_low 0 \
] [get_bd_cells xbip_multadd_0]
create_bd_cell -type ip -vlnv xilinx.com:ip:xbip_multadd:3.0 xbip_multadd_1
set_property -dict [list \
  CONFIG.c_a_type 1 \
  CONFIG.c_a_width 8 \
  CONFIG.c_ab_latency 0 \
  CONFIG.c_b_type 1 \
  CONFIG.c_b_width 16 \
  CONFIG.c_c_latency 0 \
  CONFIG.c_c_type 0 \
  CONFIG.c_c_width 24 \
  CONFIG.c_out_high 23 \
  CONFIG.c_out_low 0 \
] [get_bd_cells xbip_multadd_1]
create_bd_cell -type ip -vlnv xilinx.com:ip:xbip_multadd:3.0 xbip_multadd_2
set_property -dict [list \
  CONFIG.c_a_type 1 \
  CONFIG.c_a_width 8 \
  CONFIG.c_ab_latency 0 \
  CONFIG.c_b_type 1 \
  CONFIG.c_b_width 16 \
  CONFIG.c_c_latency 0 \
  CONFIG.c_c_type 0 \
  CONFIG.c_c_width 24 \
  CONFIG.c_out_high 23 \
  CONFIG.c_out_low 16 \
] [get_bd_cells xbip_multadd_2]
create_bd_cell -type ip -vlnv xilinx.com:ip:xbip_multadd:3.0 xbip_multadd_3
set_property -dict [list \
  CONFIG.c_a_type 1 \
  CONFIG.c_a_width 8 \
  CONFIG.c_ab_latency 0 \
  CONFIG.c_b_type 1 \
  CONFIG.c_b_width 16 \
  CONFIG.c_c_latency 0 \
  CONFIG.c_c_type 1 \
  CONFIG.c_c_width 16 \
  CONFIG.c_out_high 23 \
  CONFIG.c_out_low 0 \
] [get_bd_cells xbip_multadd_3]
create_bd_cell -type ip -vlnv xilinx.com:ip:xbip_multadd:3.0 xbip_multadd_4
set_property -dict [list \
  CONFIG.c_a_type 1 \
  CONFIG.c_a_width 8 \
  CONFIG.c_ab_latency 0 \
  CONFIG.c_b_type 1 \
  CONFIG.c_b_width 16 \
  CONFIG.c_c_latency 0 \
  CONFIG.c_c_type 0 \
  CONFIG.c_c_width 24 \
  CONFIG.c_out_high 23 \
  CONFIG.c_out_low 0 \
] [get_bd_cells xbip_multadd_4]
create_bd_cell -type ip -vlnv xilinx.com:ip:xbip_multadd:3.0 xbip_multadd_5
set_property -dict [list \
  CONFIG.c_a_type 1 \
  CONFIG.c_a_width 8 \
  CONFIG.c_ab_latency 0 \
  CONFIG.c_b_type 1 \
  CONFIG.c_b_width 16 \
  CONFIG.c_c_latency 0 \
  CONFIG.c_c_type 0 \
  CONFIG.c_c_width 24 \
  CONFIG.c_out_high 23 \
  CONFIG.c_out_low 16 \
] [get_bd_cells xbip_multadd_5]
create_bd_cell -type ip -vlnv xilinx.com:ip:xbip_multadd:3.0 xbip_multadd_6
set_property -dict [list \
  CONFIG.c_a_type 1 \
  CONFIG.c_a_width 8 \
  CONFIG.c_ab_latency 0 \
  CONFIG.c_b_type 1 \
  CONFIG.c_b_width 16 \
  CONFIG.c_c_latency 0 \
  CONFIG.c_c_type 1 \
  CONFIG.c_c_width 16 \
  CONFIG.c_out_high 23 \
  CONFIG.c_out_low 0 \
] [get_bd_cells xbip_multadd_6]
create_bd_cell -type ip -vlnv xilinx.com:ip:xbip_multadd:3.0 xbip_multadd_7
set_property -dict [list \
  CONFIG.c_a_type 1 \
  CONFIG.c_a_width 8 \
  CONFIG.c_ab_latency 0 \
  CONFIG.c_b_type 1 \
  CONFIG.c_b_width 16 \
  CONFIG.c_c_latency 0 \
  CONFIG.c_c_type 0 \
  CONFIG.c_c_width 24 \
  CONFIG.c_out_high 23 \
  CONFIG.c_out_low 0 \
] [get_bd_cells xbip_multadd_7]
create_bd_cell -type ip -vlnv xilinx.com:ip:xbip_multadd:3.0 xbip_multadd_8
set_property -dict [list \
  CONFIG.c_a_type 1 \
  CONFIG.c_a_width 8 \
  CONFIG.c_ab_latency 0 \
  CONFIG.c_b_type 1 \
  CONFIG.c_b_width 16 \
  CONFIG.c_c_latency 0 \
  CONFIG.c_c_type 0 \
  CONFIG.c_c_width 24 \
  CONFIG.c_out_high 23 \
  CONFIG.c_out_low 16 \
] [get_bd_cells xbip_multadd_8]

# ---- hierarchy /HDMI_1 ----
current_bd_instance /HDMI_1
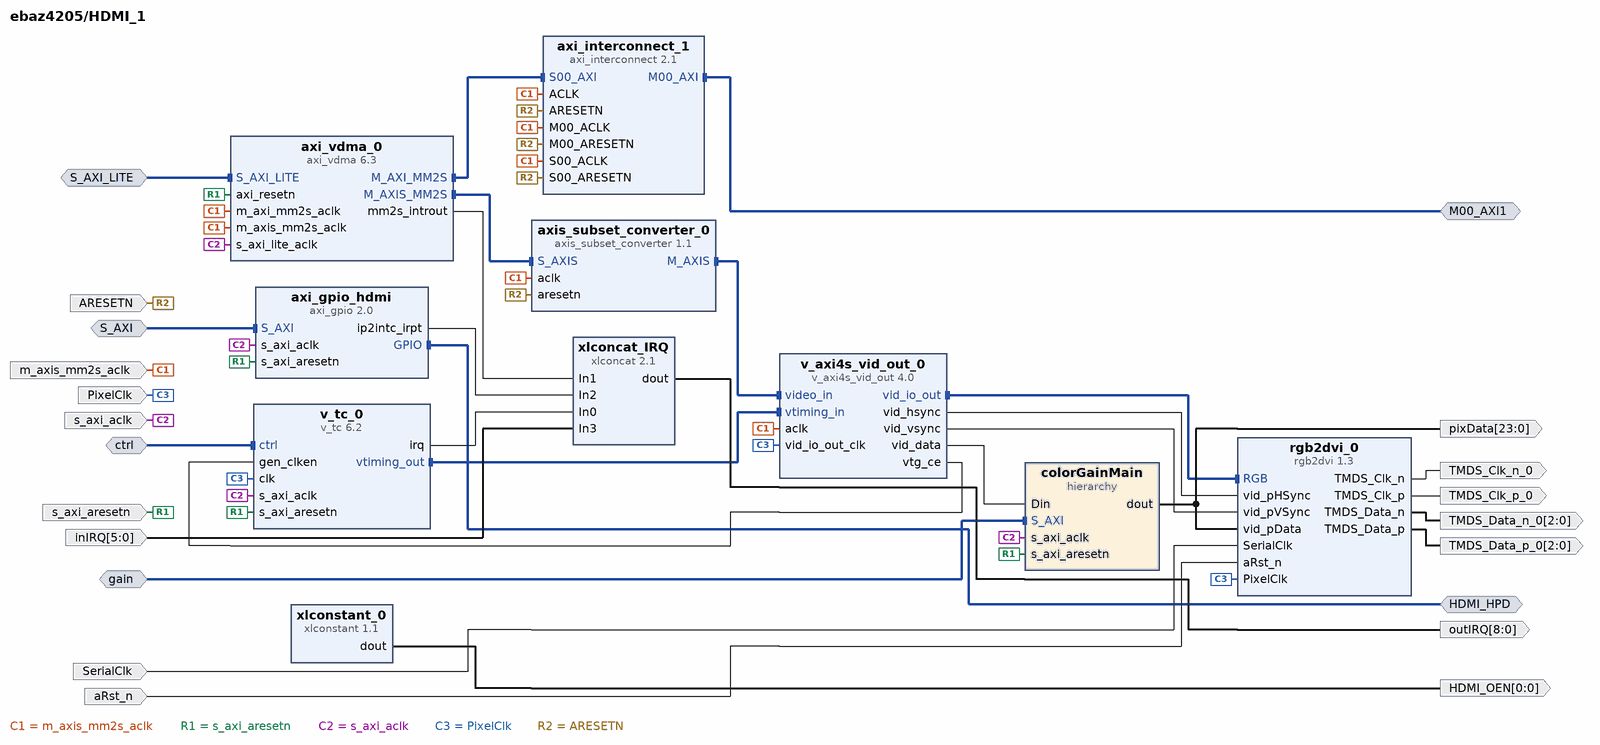
[diagram p6: block diagram inside /HDMI_1]
create_bd_intf_pin -mode Slave -vlnv xilinx.com:interface:aximm_rtl:1.0 S_AXI
create_bd_intf_pin -mode Master -vlnv xilinx.com:interface:gpio_rtl:1.0 HDMI_HPD
create_bd_intf_pin -mode Slave -vlnv xilinx.com:interface:aximm_rtl:1.0 ctrl
create_bd_intf_pin -mode Master -vlnv xilinx.com:interface:aximm_rtl:1.0 M00_AXI1
create_bd_intf_pin -mode Slave -vlnv xilinx.com:interface:aximm_rtl:1.0 S_AXI_LITE
create_bd_intf_pin -mode Slave -vlnv xilinx.com:interface:aximm_rtl:1.0 gain
create_bd_pin -dir I -type clk s_axi_aclk
create_bd_pin -dir I -type clk m_axis_mm2s_aclk
create_bd_pin -dir I -type rst s_axi_aresetn
create_bd_pin -dir O -from 0 -to 0 HDMI_OEN
create_bd_pin -dir I -type rst ARESETN
create_bd_pin -dir O TMDS_Clk_p_0
create_bd_pin -dir O TMDS_Clk_n_0
create_bd_pin -dir O -from 2 -to 0 TMDS_Data_p_0
create_bd_pin -dir O -from 2 -to 0 TMDS_Data_n_0
create_bd_pin -dir I -type rst aRst_n
create_bd_pin -dir I -type clk PixelClk
create_bd_pin -dir I SerialClk
create_bd_pin -dir O -from 8 -to 0 outIRQ
create_bd_pin -dir I -from 5 -to 0 inIRQ
create_bd_pin -dir O -from 23 -to 0 pixData

create_bd_cell -type ip -vlnv xilinx.com:ip:xlconstant:1.1 xlconstant_0
create_bd_cell -type ip -vlnv xilinx.com:ip:xlconcat:2.1 xlconcat_IRQ
set_property -dict {CONFIG.NUM_PORTS 4} [get_bd_cells xlconcat_IRQ]
create_bd_cell -type ip -vlnv xilinx.com:ip:axi_interconnect:2.1 axi_interconnect_1
set_property -dict [list \
  CONFIG.NUM_MI 1 \
  CONFIG.NUM_SI 1 \
  CONFIG.S00_HAS_DATA_FIFO 2 \
  CONFIG.S00_HAS_REGSLICE 4 \
] [get_bd_cells axi_interconnect_1]
create_bd_cell -type ip -vlnv xilinx.com:ip:axi_gpio:2.0 axi_gpio_hdmi
set_property -dict {CONFIG.C_ALL_INPUTS 1 CONFIG.C_GPIO_WIDTH 1 CONFIG.C_INTERRUPT_PRESENT 1} [get_bd_cells axi_gpio_hdmi]
create_bd_cell -type ip -vlnv xilinx.com:ip:axis_subset_converter:1.1 axis_subset_converter_0
set_property -dict [list \
  CONFIG.M_HAS_TKEEP 1 \
  CONFIG.M_HAS_TLAST 1 \
  CONFIG.M_TDATA_NUM_BYTES 3 \
  CONFIG.M_TUSER_WIDTH 1 \
  CONFIG.S_HAS_TKEEP 1 \
  CONFIG.S_HAS_TLAST 1 \
  CONFIG.S_TDATA_NUM_BYTES 4 \
  CONFIG.S_TUSER_WIDTH 1 \
  CONFIG.TDATA_REMAP {tdata[23:16],tdata[7:0],tdata[15:8]} \
  CONFIG.TKEEP_REMAP {tkeep[2:0]} \
  CONFIG.TLAST_REMAP {tlast[0]} \
  CONFIG.TUSER_REMAP {tuser[0:0]} \
] [get_bd_cells axis_subset_converter_0]
create_bd_cell -type ip -vlnv digilentinc.com:ip:rgb2dvi:1.3 rgb2dvi_0
set_property -dict {CONFIG.kClkRange 2 CONFIG.kGenerateSerialClk false CONFIG.kRstActiveHigh false} [get_bd_cells rgb2dvi_0]
create_bd_cell -type ip -vlnv xilinx.com:ip:v_axi4s_vid_out:4.0 v_axi4s_vid_out_0
set_property -dict {CONFIG.C_ADDR_WIDTH 12 CONFIG.C_HAS_ASYNC_CLK 1 CONFIG.C_VTG_MASTER_SLAVE 1} [get_bd_cells v_axi4s_vid_out_0]
create_bd_cell -type ip -vlnv xilinx.com:ip:v_tc:6.2 v_tc_0
set_property -dict {CONFIG.enable_detection false} [get_bd_cells v_tc_0]
create_bd_cell -type ip -vlnv xilinx.com:ip:axi_vdma:6.3 axi_vdma_0
set_property -dict [list \
  CONFIG.c_include_s2mm 0 \
  CONFIG.c_m_axis_mm2s_tdata_width 32 \
  CONFIG.c_mm2s_linebuffer_depth 4096 \
  CONFIG.c_mm2s_max_burst_length 16 \
  CONFIG.c_num_fstores 3 \
] [get_bd_cells axi_vdma_0]
create_bd_cell -type hier colorGainMain

# ---- hierarchy /HDMI_1/colorGainMain ----
current_bd_instance /HDMI_1/colorGainMain
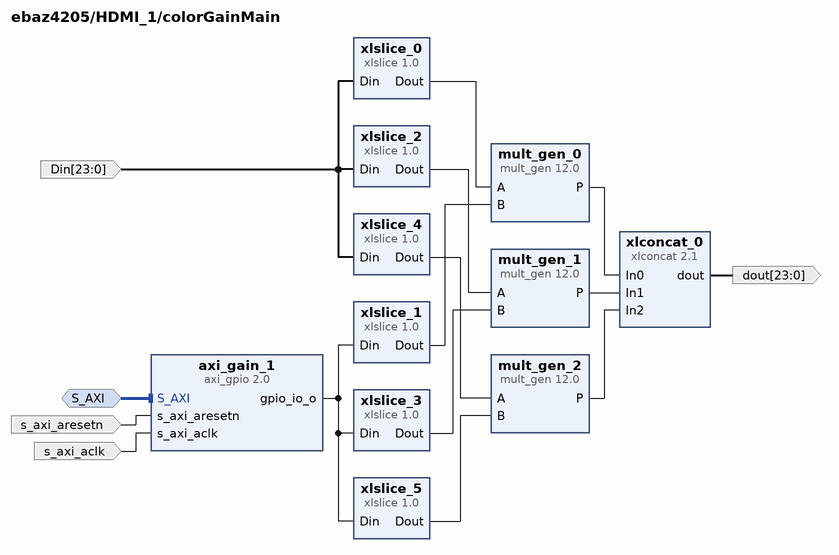
[diagram p7: block diagram inside /HDMI_1/colorGainMain]
create_bd_intf_pin -mode Slave -vlnv xilinx.com:interface:aximm_rtl:1.0 S_AXI
create_bd_pin -dir I -from 23 -to 0 Din
create_bd_pin -dir I -type clk s_axi_aclk
create_bd_pin -dir I -type rst s_axi_aresetn
create_bd_pin -dir O -from 23 -to 0 dout

create_bd_cell -type ip -vlnv xilinx.com:ip:xlslice:1.0 xlslice_0
set_property -dict {CONFIG.DIN_TO 0 CONFIG.DIN_WIDTH 24 CONFIG.DOUT_WIDTH 8} [get_bd_cells xlslice_0]
create_bd_cell -type ip -vlnv xilinx.com:ip:mult_gen:12.0 mult_gen_1
set_property -dict [list \
  CONFIG.MultType Parallel_Multiplier \
  CONFIG.OutputWidthLow 8 \
  CONFIG.PipeStages 0 \
  CONFIG.PortAType Unsigned \
  CONFIG.PortAWidth 8 \
  CONFIG.PortBType Unsigned \
  CONFIG.PortBWidth 8 \
  CONFIG.Use_Custom_Output_Width true \
] [get_bd_cells mult_gen_1]
create_bd_cell -type ip -vlnv xilinx.com:ip:xlslice:1.0 xlslice_1
set_property -dict {CONFIG.DIN_TO 0 CONFIG.DIN_WIDTH 24 CONFIG.DOUT_WIDTH 8} [get_bd_cells xlslice_1]
create_bd_cell -type ip -vlnv xilinx.com:ip:xlslice:1.0 xlslice_2
set_property -dict {CONFIG.DIN_FROM 15 CONFIG.DIN_TO 8 CONFIG.DIN_WIDTH 24 CONFIG.DOUT_WIDTH 8} [get_bd_cells xlslice_2]
create_bd_cell -type ip -vlnv xilinx.com:ip:mult_gen:12.0 mult_gen_2
set_property -dict [list \
  CONFIG.MultType Parallel_Multiplier \
  CONFIG.OutputWidthLow 8 \
  CONFIG.PipeStages 0 \
  CONFIG.PortAType Unsigned \
  CONFIG.PortAWidth 8 \
  CONFIG.PortBType Unsigned \
  CONFIG.PortBWidth 8 \
  CONFIG.Use_Custom_Output_Width true \
] [get_bd_cells mult_gen_2]
create_bd_cell -type ip -vlnv xilinx.com:ip:xlslice:1.0 xlslice_3
set_property -dict {CONFIG.DIN_FROM 15 CONFIG.DIN_TO 8 CONFIG.DIN_WIDTH 24 CONFIG.DOUT_WIDTH 8} [get_bd_cells xlslice_3]
create_bd_cell -type ip -vlnv xilinx.com:ip:xlslice:1.0 xlslice_4
set_property -dict {CONFIG.DIN_FROM 23 CONFIG.DIN_TO 16 CONFIG.DIN_WIDTH 24 CONFIG.DOUT_WIDTH 8} [get_bd_cells xlslice_4]
create_bd_cell -type ip -vlnv xilinx.com:ip:xlslice:1.0 xlslice_5
set_property -dict {CONFIG.DIN_FROM 23 CONFIG.DIN_TO 16 CONFIG.DIN_WIDTH 24 CONFIG.DOUT_WIDTH 8} [get_bd_cells xlslice_5]
create_bd_cell -type ip -vlnv xilinx.com:ip:axi_gpio:2.0 axi_gain_1
set_property -dict {CONFIG.C_ALL_OUTPUTS 1 CONFIG.C_DOUT_DEFAULT 0x00FFFFFF CONFIG.C_GPIO_WIDTH 24} [get_bd_cells axi_gain_1]
create_bd_cell -type ip -vlnv xilinx.com:ip:mult_gen:12.0 mult_gen_0
set_property -dict [list \
  CONFIG.MultType Parallel_Multiplier \
  CONFIG.OutputWidthLow 8 \
  CONFIG.PipeStages 0 \
  CONFIG.PortAType Unsigned \
  CONFIG.PortAWidth 8 \
  CONFIG.PortBType Unsigned \
  CONFIG.PortBWidth 8 \
  CONFIG.Use_Custom_Output_Width true \
] [get_bd_cells mult_gen_0]
create_bd_cell -type ip -vlnv xilinx.com:ip:xlconcat:2.1 xlconcat_0
set_property -dict {CONFIG.IN0_WIDTH 8 CONFIG.IN1_WIDTH 8 CONFIG.IN2_WIDTH 8 CONFIG.NUM_PORTS 3} [get_bd_cells xlconcat_0]

# ---- connections ----

current_bd_instance /PS
connect_bd_intf_net [get_bd_intf_pins M_AXI_GP0] [get_bd_intf_pins processing_system7_0/M_AXI_GP0]
connect_bd_intf_net [get_bd_intf_pins S_AXI_HP0] [get_bd_intf_pins processing_system7_0/S_AXI_HP0]
connect_bd_intf_net [get_bd_intf_pins S_AXI_HP2] [get_bd_intf_pins processing_system7_0/S_AXI_HP2]
connect_bd_intf_net [get_bd_intf_pins DDR] [get_bd_intf_pins processing_system7_0/DDR]
connect_bd_intf_net [get_bd_intf_pins FIXED_IO] [get_bd_intf_pins processing_system7_0/FIXED_IO]
connect_bd_intf_net [get_bd_intf_pins MDIO_ETHERNET_0_0] [get_bd_intf_pins processing_system7_0/MDIO_ETHERNET_0]
connect_bd_net [get_bd_pins DivideBy2_50MHz/clk_out] [get_bd_pins clk_out]
connect_bd_net [get_bd_pins DivideBy4_25MHz/clk_out] [get_bd_pins CLK_25M]
connect_bd_net -net ENET0_GMII_RX_CLK_0_1 [get_bd_pins ENET0_GMII_RX_CLK_0] \
  [get_bd_pins rst_ENET0_GMII_RX_CLK_0_100M/slowest_sync_clk] [get_bd_pins processing_system7_0/ENET0_GMII_RX_CLK]
connect_bd_net -net ENET0_GMII_RX_DV_0_1 [get_bd_pins ENET0_GMII_RX_DV_0] [get_bd_pins processing_system7_0/ENET0_GMII_RX_DV]
connect_bd_net -net ENET0_GMII_TX_CLK_0_1 [get_bd_pins ENET0_GMII_TX_CLK_0] [get_bd_pins processing_system7_0/ENET0_GMII_TX_CLK]
connect_bd_net [get_bd_pins IRQ_F2P] [get_bd_pins processing_system7_0/IRQ_F2P]
connect_bd_net -net In0_0_1 [get_bd_pins enet0_gmii_rxd] [get_bd_pins xlconcat_0/In0]
connect_bd_net [get_bd_pins clk_wiz_128M/clk_out1] [get_bd_pins FCLK_CLK1_128M] [get_bd_pins proc_sys_reset_128M/slowest_sync_clk]
connect_bd_net -net proc_sys_reset_0_peripheral_aresetn [get_bd_pins proc_sys_reset_0_100M/peripheral_aresetn] \
  [get_bd_pins ARESETN] [get_bd_pins DivideBy2_50MHz/resetn] [get_bd_pins rst_ENET0_GMII_RX_CLK_0_100M/ext_reset_in]
connect_bd_net -net proc_sys_reset_0_peripheral_reset [get_bd_pins proc_sys_reset_0_100M/peripheral_reset] [get_bd_pins peripheral_reset]
connect_bd_net [get_bd_pins processing_system7_0/ENET0_GMII_TXD] [get_bd_pins xlslice_0/Din]
connect_bd_net [get_bd_pins processing_system7_0/ENET0_GMII_TX_EN] [get_bd_pins ENET0_GMII_TX_EN_0]
connect_bd_net [get_bd_pins processing_system7_0/FCLK_CLK0] \
  [get_bd_pins FCLK_CLK0_100M] [get_bd_pins DivideBy2_50MHz/clk] [get_bd_pins DivideBy4_25MHz/clk] \
  [get_bd_pins proc_sys_reset_0_100M/slowest_sync_clk] [get_bd_pins processing_system7_0/M_AXI_GP0_ACLK]
connect_bd_net [get_bd_pins processing_system7_0/FCLK_CLK1] \
  [get_bd_pins ADC_clk_64M] [get_bd_pins clk_wiz_128M/clk_in1] [get_bd_pins rst_ps7_0_64M/slowest_sync_clk]
connect_bd_net -net processing_system7_0_FCLK_CLK2_140M [get_bd_pins processing_system7_0/FCLK_CLK2] \
  [get_bd_pins FCLK_CLK2_140M] [get_bd_pins processing_system7_0/S_AXI_HP0_ACLK] \
  [get_bd_pins rst_ps7_0_140M/slowest_sync_clk] [get_bd_pins processing_system7_0/S_AXI_HP2_ACLK]
connect_bd_net [get_bd_pins processing_system7_0/FCLK_RESET0_N] \
  [get_bd_pins proc_sys_reset_128M/ext_reset_in] [get_bd_pins proc_sys_reset_0_100M/ext_reset_in] \
  [get_bd_pins rst_ps7_0_140M/ext_reset_in] [get_bd_pins rst_ps7_0_64M/ext_reset_in]
connect_bd_net [get_bd_pins rst_ps7_0_140M/peripheral_aresetn] [get_bd_pins peripheral_aresetn1]
connect_bd_net -net rst_ps7_0_64M_peripheral_aresetn [get_bd_pins proc_sys_reset_128M/peripheral_aresetn] [get_bd_pins peripheral_aresetn_128M]
connect_bd_net [get_bd_pins rst_ps7_0_64M/peripheral_aresetn] [get_bd_pins peripheral_aresetn] [get_bd_pins clk_wiz_128M/resetn]
connect_bd_net [get_bd_pins xlconcat_0/dout] [get_bd_pins processing_system7_0/ENET0_GMII_RXD]
connect_bd_net [get_bd_pins xlconstant_0/dout] [get_bd_pins DivideBy4_25MHz/resetn]
connect_bd_net [get_bd_pins xlslice_0/Dout] [get_bd_pins enet0_gmii_txd]

current_bd_instance /HDMI_0
connect_bd_intf_net [get_bd_intf_pins M00_AXI1] [get_bd_intf_pins axi_interconnect_1/M00_AXI]
connect_bd_intf_net [get_bd_intf_pins S_AXI_LITE_VDMA] [get_bd_intf_pins axi_vdma_0/S_AXI_LITE]
connect_bd_intf_net [get_bd_intf_pins ctrl] [get_bd_intf_pins v_tc_0/ctrl]
connect_bd_intf_net [get_bd_intf_pins S_AXI] [get_bd_intf_pins axi_gpio_hdmi/S_AXI]
connect_bd_intf_net [get_bd_intf_pins S_AXI_LITE_MIXER_0] [get_bd_intf_pins mixerMatrix/S_AXI_LITE_MIXER_G_RR]
connect_bd_intf_net [get_bd_intf_pins S_AXI_LITE_MIXER_1] [get_bd_intf_pins mixerMatrix/S_AXI_LITE_MIXER_G_BR]
connect_bd_intf_net [get_bd_intf_pins S_AXI_LITE_MIXER_2] [get_bd_intf_pins mixerMatrix/S_AXI_LITE_MIXER_G_GR]
connect_bd_intf_net [get_bd_intf_pins S_AXI_LITE_MIXER_3] [get_bd_intf_pins mixerMatrix/S_AXI_LITE_MIXER_G_RB]
connect_bd_intf_net [get_bd_intf_pins S_AXI_LITE_MIXER_4] [get_bd_intf_pins mixerMatrix/S_AXI_LITE_MIXER_G_BB]
connect_bd_intf_net [get_bd_intf_pins S_AXI_LITE_MIXER_5] [get_bd_intf_pins mixerMatrix/S_AXI_LITE_MIXER_G_GB]
connect_bd_intf_net [get_bd_intf_pins S_AXI_LITE_MIXER_6] [get_bd_intf_pins mixerMatrix/S_AXI_LITE_MIXER_G_RG]
connect_bd_intf_net [get_bd_intf_pins S_AXI_LITE_MIXER_7] [get_bd_intf_pins mixerMatrix/S_AXI_LITE_MIXER_G_BG]
connect_bd_intf_net [get_bd_intf_pins S_AXI_LITE_MIXER_8] [get_bd_intf_pins mixerMatrix/S_AXI_LITE_MIXER_G_GG]
connect_bd_intf_net [get_bd_intf_pins HDMI_HPD] [get_bd_intf_pins axi_gpio_hdmi/GPIO]
connect_bd_intf_net [get_bd_intf_pins axis_subset_converter_0/S_AXIS] [get_bd_intf_pins axi_vdma_0/M_AXIS_MM2S]
connect_bd_intf_net [get_bd_intf_pins axi_interconnect_1/S00_AXI] [get_bd_intf_pins axi_vdma_0/M_AXI_MM2S]
connect_bd_intf_net [get_bd_intf_pins axis_subset_converter_0/M_AXIS] [get_bd_intf_pins v_axi4s_vid_out_0/video_in]
connect_bd_intf_net [get_bd_intf_pins dds_stream_s] [get_bd_intf_pins dds_compiler_0/S_AXIS_CONFIG]
connect_bd_intf_net [get_bd_intf_pins gain] [get_bd_intf_pins colorGainMain/S_AXI]
connect_bd_intf_net [get_bd_intf_pins v_axi4s_vid_out_0/vid_io_out] [get_bd_intf_pins rgb2dvi_0/RGB]
connect_bd_intf_net [get_bd_intf_pins v_tc_0/vtiming_out] [get_bd_intf_pins v_axi4s_vid_out_0/vtiming_in]
connect_bd_net -net Din_1 [get_bd_pins mixerMatrix/dout] [get_bd_pins colorGainMain/Din]
connect_bd_net -net In3_1 [get_bd_pins In3] [get_bd_pins xlconcat_IRQ/In3]
connect_bd_net -net In4_1 [get_bd_pins In4] [get_bd_pins xlconcat_IRQ/In4]
connect_bd_net -net In5_1 [get_bd_pins In5] [get_bd_pins xlconcat_IRQ/In5]
connect_bd_net [get_bd_pins m_axis_mm2s_aclk] \
  [get_bd_pins axi_interconnect_1/ACLK] [get_bd_pins axi_interconnect_1/M00_ACLK] [get_bd_pins axi_interconnect_1/S00_ACLK] \
  [get_bd_pins axis_subset_converter_0/aclk] [get_bd_pins v_axi4s_vid_out_0/aclk] [get_bd_pins axi_vdma_0/m_axi_mm2s_aclk] \
  [get_bd_pins axi_vdma_0/m_axis_mm2s_aclk]
connect_bd_net -net PS_ARESETN [get_bd_pins s_axi_aresetn] \
  [get_bd_pins axi_gpio_hdmi/s_axi_aresetn] [get_bd_pins v_tc_0/s_axi_aresetn] [get_bd_pins axi_vdma_0/axi_resetn] \
  [get_bd_pins mixerMatrix/s_axi_aresetn] [get_bd_pins dds_compiler_0/aresetn]
connect_bd_net -net PS_FCLK_CLK0 [get_bd_pins s_axi_aclk] \
  [get_bd_pins axi_gpio_hdmi/s_axi_aclk] [get_bd_pins v_tc_0/s_axi_aclk] [get_bd_pins axi_vdma_0/s_axi_lite_aclk] \
  [get_bd_pins colorGainMain/s_axi_aclk] [get_bd_pins mixerMatrix/s_axi_aclk] [get_bd_pins dds_compiler_0/aclk]
connect_bd_net [get_bd_pins SerialClk] [get_bd_pins rgb2dvi_0/SerialClk]
connect_bd_net [get_bd_pins aRst_n] [get_bd_pins rgb2dvi_0/aRst_n] [get_bd_pins v_axi4s_vid_out_0/aresetn]
connect_bd_net -net axi_dynclk_0_PXL_CLK_O [get_bd_pins PixelClk] \
  [get_bd_pins rgb2dvi_0/PixelClk] [get_bd_pins v_axi4s_vid_out_0/vid_io_out_clk] [get_bd_pins v_tc_0/clk] \
  [get_bd_pins mixerMatrix/PixelClk]
connect_bd_net [get_bd_pins axi_gpio_hdmi/ip2intc_irpt] [get_bd_pins xlconcat_IRQ/In2]
connect_bd_net [get_bd_pins axi_vdma_0/mm2s_introut] [get_bd_pins xlconcat_IRQ/In1]
connect_bd_net [get_bd_pins c_addsub_0/S] [get_bd_pins mixerMatrix/din1]
connect_bd_net -net colorGain_dout [get_bd_pins colorGainMain/dout] [get_bd_pins rgb2dvi_0/vid_pData] [get_bd_pins pixData]
connect_bd_net [get_bd_pins dds_compiler_0/m_axis_data_tdata] [get_bd_pins c_addsub_0/A]
connect_bd_net [get_bd_pins dds_compiler_0/m_axis_phase_tdata] [get_bd_pins mixerMatrix/din2]
connect_bd_net [get_bd_pins pixIn] [get_bd_pins mixerMatrix/din0]
connect_bd_net [get_bd_pins rgb2dvi_0/TMDS_Clk_n] [get_bd_pins TMDS_Clk_n_0]
connect_bd_net [get_bd_pins rgb2dvi_0/TMDS_Clk_p] [get_bd_pins TMDS_Clk_p_0]
connect_bd_net [get_bd_pins rgb2dvi_0/TMDS_Data_n] [get_bd_pins TMDS_Data_n_0]
connect_bd_net [get_bd_pins rgb2dvi_0/TMDS_Data_p] [get_bd_pins TMDS_Data_p_0]
connect_bd_net -net rst_ps7_0_140M_peripheral_aresetn [get_bd_pins ARESETN] \
  [get_bd_pins axi_interconnect_1/ARESETN] [get_bd_pins axi_interconnect_1/S00_ARESETN] \
  [get_bd_pins axi_interconnect_1/M00_ARESETN] [get_bd_pins axis_subset_converter_0/aresetn] \
  [get_bd_pins colorGainMain/s_axi_aresetn]
connect_bd_net [get_bd_pins v_axi4s_vid_out_0/vid_data] [get_bd_pins mixerMatrix/Din]
connect_bd_net [get_bd_pins v_axi4s_vid_out_0/vid_hsync] [get_bd_pins rgb2dvi_0/vid_pHSync]
connect_bd_net [get_bd_pins v_axi4s_vid_out_0/vid_vsync] [get_bd_pins rgb2dvi_0/vid_pVSync]
connect_bd_net [get_bd_pins v_axi4s_vid_out_0/vtg_ce] [get_bd_pins v_tc_0/gen_clken]
connect_bd_net [get_bd_pins v_tc_0/irq] [get_bd_pins xlconcat_IRQ/In0]
connect_bd_net [get_bd_pins xlconcat_IRQ/dout] [get_bd_pins dout]
connect_bd_net [get_bd_pins xlconstant_0/dout] [get_bd_pins HDMI_OEN]

current_bd_instance /HDMI_0/colorGainMain
connect_bd_intf_net [get_bd_intf_pins S_AXI] [get_bd_intf_pins axi_gpio_0/S_AXI]
connect_bd_net -net axi_gain_1_gpio_io_o [get_bd_pins axi_gpio_0/gpio_io_o] \
  [get_bd_pins xlslice_1/Din] [get_bd_pins xlslice_3/Din] [get_bd_pins xlslice_5/Din]
connect_bd_net [get_bd_pins mult_gen_0/P] [get_bd_pins xlconcat_0/In0]
connect_bd_net [get_bd_pins mult_gen_1/P] [get_bd_pins xlconcat_0/In1]
connect_bd_net [get_bd_pins mult_gen_2/P] [get_bd_pins xlconcat_0/In2]
connect_bd_net [get_bd_pins s_axi_aclk] [get_bd_pins axi_gpio_0/s_axi_aclk]
connect_bd_net [get_bd_pins s_axi_aresetn] [get_bd_pins axi_gpio_0/s_axi_aresetn]
connect_bd_net -net v_axi4s_vid_out_0_vid_data [get_bd_pins Din] [get_bd_pins xlslice_2/Din] [get_bd_pins xlslice_4/Din] [get_bd_pins xlslice_0/Din]
connect_bd_net [get_bd_pins xlconcat_0/dout] [get_bd_pins dout]
connect_bd_net [get_bd_pins xlslice_0/Dout] [get_bd_pins mult_gen_0/A]
connect_bd_net [get_bd_pins xlslice_1/Dout] [get_bd_pins mult_gen_0/B]
connect_bd_net [get_bd_pins xlslice_2/Dout] [get_bd_pins mult_gen_1/A]
connect_bd_net [get_bd_pins xlslice_3/Dout] [get_bd_pins mult_gen_1/B]
connect_bd_net [get_bd_pins xlslice_4/Dout] [get_bd_pins mult_gen_2/A]
connect_bd_net [get_bd_pins xlslice_5/Dout] [get_bd_pins mult_gen_2/B]

current_bd_instance /HDMI_0/mixerMatrix
connect_bd_intf_net [get_bd_intf_pins S_AXI_LITE_MIXER_G_RR] [get_bd_intf_pins mixer_0/S00_AXI]
connect_bd_intf_net [get_bd_intf_pins S_AXI_LITE_MIXER_G_BR] [get_bd_intf_pins mixer_1/S00_AXI]
connect_bd_intf_net [get_bd_intf_pins S_AXI_LITE_MIXER_G_GR] [get_bd_intf_pins mixer_2/S00_AXI]
connect_bd_intf_net [get_bd_intf_pins S_AXI_LITE_MIXER_G_GB] [get_bd_intf_pins mixer_3/S00_AXI]
connect_bd_intf_net [get_bd_intf_pins S_AXI_LITE_MIXER_G_RB] [get_bd_intf_pins mixer_4/S00_AXI]
connect_bd_intf_net [get_bd_intf_pins S_AXI_LITE_MIXER_G_BB] [get_bd_intf_pins mixer_5/S00_AXI]
connect_bd_intf_net [get_bd_intf_pins S_AXI_LITE_MIXER_G_GG] [get_bd_intf_pins mixer_6/S00_AXI]
connect_bd_intf_net [get_bd_intf_pins S_AXI_LITE_MIXER_G_RG] [get_bd_intf_pins mixer_7/S00_AXI]
connect_bd_intf_net [get_bd_intf_pins S_AXI_LITE_MIXER_G_BG] [get_bd_intf_pins mixer_8/S00_AXI]
connect_bd_net [get_bd_pins Din] [get_bd_pins colorGainMatrix/Din]
connect_bd_net [get_bd_pins PixelClk] \
  [get_bd_pins mixer_0/pix_clk] [get_bd_pins mixer_1/pix_clk] [get_bd_pins mixer_2/pix_clk] [get_bd_pins mixer_3/pix_clk] \
  [get_bd_pins mixer_6/pix_clk] [get_bd_pins mixer_4/pix_clk] [get_bd_pins mixer_7/pix_clk] [get_bd_pins mixer_5/pix_clk] \
  [get_bd_pins mixer_8/pix_clk]
connect_bd_net [get_bd_pins colorGainMatrix/dout] [get_bd_pins dout]
connect_bd_net -net din0_1 [get_bd_pins din0] [get_bd_pins xlslice_0/Din] [get_bd_pins xlslice_2/Din] [get_bd_pins xlslice_1/Din]
connect_bd_net -net din1_1 [get_bd_pins din1] \
  [get_bd_pins mixer_0/din1] [get_bd_pins mixer_1/din1] [get_bd_pins mixer_2/din1] [get_bd_pins mixer_3/din1] \
  [get_bd_pins mixer_6/din1] [get_bd_pins mixer_4/din1] [get_bd_pins mixer_7/din1] [get_bd_pins mixer_5/din1] \
  [get_bd_pins mixer_8/din1]
connect_bd_net -net din2_1 [get_bd_pins din2] \
  [get_bd_pins mixer_0/din2] [get_bd_pins mixer_1/din2] [get_bd_pins mixer_2/din2] [get_bd_pins mixer_3/din2] \
  [get_bd_pins mixer_6/din2] [get_bd_pins mixer_4/din2] [get_bd_pins mixer_7/din2] [get_bd_pins mixer_5/din2] \
  [get_bd_pins mixer_8/din2]
connect_bd_net -net g_rr_1 [get_bd_pins mixer_0/dout] [get_bd_pins colorGainMatrix/g_rr]
connect_bd_net [get_bd_pins mixer_1/dout] [get_bd_pins colorGainMatrix/g_br]
connect_bd_net [get_bd_pins mixer_2/dout] [get_bd_pins colorGainMatrix/g_gr]
connect_bd_net [get_bd_pins mixer_3/dout] [get_bd_pins colorGainMatrix/g_gb]
connect_bd_net [get_bd_pins mixer_4/dout] [get_bd_pins colorGainMatrix/g_rb]
connect_bd_net [get_bd_pins mixer_5/dout] [get_bd_pins colorGainMatrix/g_bb]
connect_bd_net [get_bd_pins mixer_6/dout] [get_bd_pins colorGainMatrix/g_gg]
connect_bd_net [get_bd_pins mixer_7/dout] [get_bd_pins colorGainMatrix/g_rg]
connect_bd_net [get_bd_pins mixer_8/dout] [get_bd_pins colorGainMatrix/g_bg]
connect_bd_net [get_bd_pins s_axi_aclk] \
  [get_bd_pins mixer_0/s00_axi_aclk] [get_bd_pins mixer_1/s00_axi_aclk] [get_bd_pins mixer_2/s00_axi_aclk] \
  [get_bd_pins mixer_3/s00_axi_aclk] [get_bd_pins mixer_6/s00_axi_aclk] [get_bd_pins mixer_4/s00_axi_aclk] \
  [get_bd_pins mixer_7/s00_axi_aclk] [get_bd_pins mixer_5/s00_axi_aclk] [get_bd_pins mixer_8/s00_axi_aclk]
connect_bd_net [get_bd_pins s_axi_aresetn] \
  [get_bd_pins mixer_0/s00_axi_aresetn] [get_bd_pins mixer_1/s00_axi_aresetn] [get_bd_pins mixer_2/s00_axi_aresetn] \
  [get_bd_pins mixer_3/s00_axi_aresetn] [get_bd_pins mixer_6/s00_axi_aresetn] [get_bd_pins mixer_4/s00_axi_aresetn] \
  [get_bd_pins mixer_7/s00_axi_aresetn] [get_bd_pins mixer_5/s00_axi_aresetn] [get_bd_pins mixer_8/s00_axi_aresetn]
connect_bd_net [get_bd_pins xlslice_0/Dout] [get_bd_pins mixer_0/din0] [get_bd_pins mixer_1/din0] [get_bd_pins mixer_2/din0]
connect_bd_net [get_bd_pins xlslice_1/Dout] [get_bd_pins mixer_3/din0] [get_bd_pins mixer_4/din0] [get_bd_pins mixer_5/din0]
connect_bd_net [get_bd_pins xlslice_2/Dout] [get_bd_pins mixer_6/din0] [get_bd_pins mixer_7/din0] [get_bd_pins mixer_8/din0]
